# Altium schematic sheet Sheet1.SchDoc
size A3
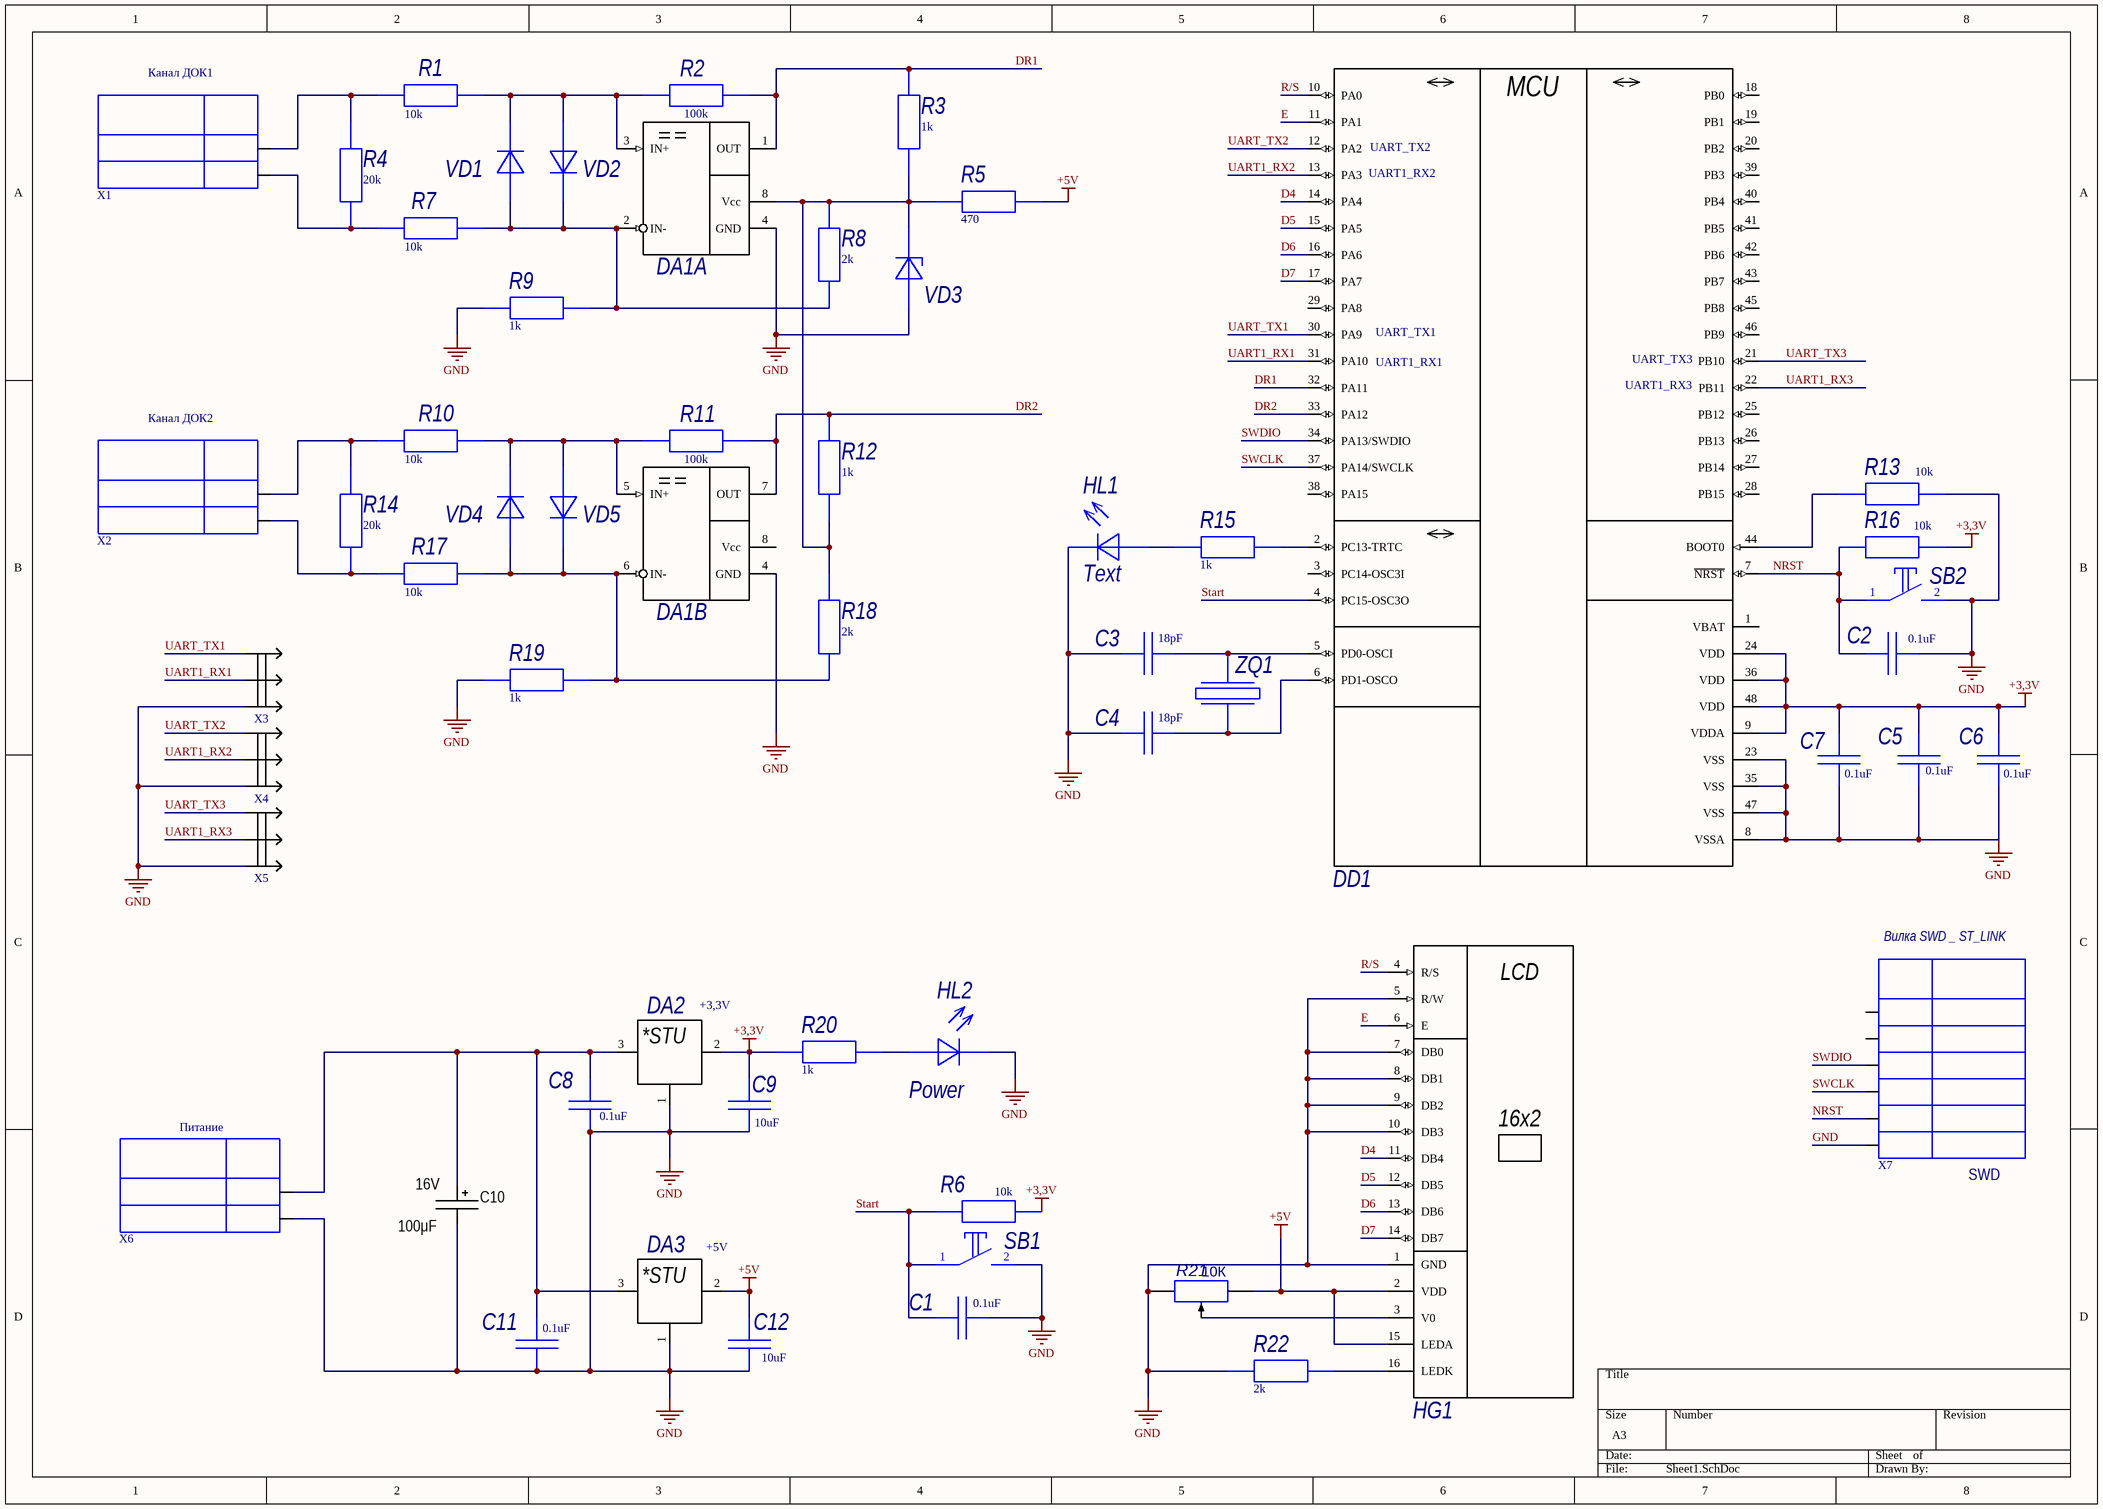
[diagram p0: Sheet1.SchDoc]

## Parts
C1  value 0.1uF  [C0805]  (hidden comment: Capacitor)
C2  value 0.1uF  [C0805]  (hidden comment: Capacitor)
C3  value 18pF  [C0603]  (hidden comment: Capacitor)
C4  value 18pF  [C0603]  (hidden comment: Capacitor)
C5  value 0.1uF  [C0805]  (hidden comment: Capacitor)
C6  value 0.1uF  [C0805]  (hidden comment: Capacitor)
C7  value 0.1uF  [C0805]  (hidden comment: Capacitor)
C8  value 0.1uF  [C0805]  (hidden comment: Capacitor)
C9  value 10uF  [C0805]  (hidden comment: Capacitor)
C10  value 100μF  Voltage: 16V  [CAP: D5C2H11]
C11  value 0.1uF  [C0805]  (hidden comment: Capacitor)
C12  value 10uF  [C0805]  (hidden comment: Capacitor)
DA1  COMP_2x_8p  [SOIC-8]  (value not drawn)  (parts A,B of 2)
DA2  Output Voltage: +3,3V  [SOT-223]  (hidden comment: LM1117-Series)
DA3  Output Voltage: +5V  [SOT-223]  (hidden comment: LM1117-Series)
DD1  STM32F103Cxxx-Series  [LQFP-48]  (value not drawn)
HG1  QC1602AV2_0  [QC1602AV2_0 _PLS]  (value not drawn)
HL1  Text  [LD-3mm-G]
HL2  Power  [LD-3mm-R]
R1  value 10k  [R0805]  (hidden comment: Resistor)
R2  value 100k  [R0805]  (hidden comment: Resistor)
R3  value 1k  [R0805]  (hidden comment: Resistor)
R4  value 20k  [R0603]  (hidden comment: Resistor)
R5  value 470  [R0805]  (hidden comment: Resistor)
R6  value 10k  [R0805]  (hidden comment: Resistor)
R7  value 10k  [R0805]  (hidden comment: Resistor)
R8  value 2k  [R0805]  (hidden comment: Resistor)
R9  value 1k  [R0805]  (hidden comment: Resistor)
R10  value 10k  [R0805]  (hidden comment: Resistor)
R11  value 100k  [R0805]  (hidden comment: Resistor)
R12  value 1k  [R0805]  (hidden comment: Resistor)
R13  value 10k  [R0805]  (hidden comment: Resistor)
R14  value 20k  [R0603]  (hidden comment: Resistor)
R15  value 1k  [R0805]  (hidden comment: Resistor)
R16  value 10k  [R0805]  (hidden comment: Resistor)
R17  value 10k  [R0805]  (hidden comment: Resistor)
R18  value 2k  [R0805]  (hidden comment: Resistor)
R19  value 1k  [R0805]  (hidden comment: Resistor)
R20  value 1k  [R0805]  (hidden comment: Resistor)
R21  value 10К  [CA9V]  (hidden comment: Potentiometer)
R22  value 2k  [R0805]  (hidden comment: Resistor)
SB1  Text  [TS-A3PS]  (value not drawn)
SB2  Text  [TS-A3PS]  (value not drawn)
VD1  Diode  [DO-214AC]  (value not drawn)
VD2  Diode  [DO-214AC]  (value not drawn)
VD3  Zener  [SOD-80]  (value not drawn)
VD4  Diode  [DO-214AC]  (value not drawn)
VD5  Diode  [DO-214AC]  (value not drawn)
X1  Канал ДОК1  [2EDGV-5.0-02P-14]
X2  Канал ДОК2  [2EDGV-5.0-02P-14]
X3  Разъем PLS-3  [HDR1X3]  (value not drawn)
X4  Разъем PLS-3  [HDR1X3]  (value not drawn)
X5  Разъем PLS-3  [HDR1X3]  (value not drawn)
X6  Питание  [2EDGV-5.0-02P-14]
X7  Вилка SWD _ ST_LINK  value SWD  [PLD6]
ZQ1  Crystal  [HC-49SM]  (value not drawn)

## Nets
+3,3V: C5.2 C6.2 C7.2 C9.2 DA2.2(Out) DD1.9(VDDA) DD1.24(VDD) DD1.36(VDD) DD1.48(VDD) R6.1 R16.1 R20.1
+5V: C12.2 DA3.2(Out) HG1.2(VDD) HG1.15(LEDA) R5.2 R21.1
GND: C1.1 C2.1 C3.1 C4.1 C5.1 C6.1 C7.1 C8.1 C9.1 C10.2 C11.1 C12.1 DA1.4(GND) DA2.1(Adj/GND) DA3.1(Adj/GND) DD1.8(VSSA) DD1.23(VSS) DD1.35(VSS) DD1.47(VSS) HG1.1(GND) HG1.5(R/W) HG1.7(DB0) HG1.8(DB1) HG1.9(DB2) HG1.10(DB3) HL1.2(К) HL2.2(К) R9.1 R13.1 R19.1 R21.2 R22.2 SB1.2 SB2.2 VD3.1(А) X3.1 X4.1 X5.1 X6.2(PIN1) X7.6
D4: DD1.14(PA4) HG1.11(DB4)
D5: DD1.15(PA5) HG1.12(DB5)
D6: DD1.16(PA6) HG1.13(DB6)
D7: DD1.17(PA7) HG1.14(DB7)
DR1: DA1.1(OUT) DD1.32(PA11) R2.2 R3.2
DR2: DA1.7(OUT) DD1.33(PA12) R11.2 R12.2
E: DD1.11(PA1) HG1.6(E)
NRST: C2.2 DD1.7(~{NRST}) R16.2 SB2.1 X7.5
R/S: DD1.10(PA0) HG1.4(R/S)
Start: C1.2 DD1.4(PC15-OSC3O) R6.2 SB1.1
SWCLK: DD1.37(PA14/SWCLK) X7.4
SWDIO: DD1.34(PA13/SWDIO) X7.3(GND)
UART1_RX1: DD1.31(PA10) X3.2
UART1_RX2: DD1.13(PA3) X4.2
UART1_RX3: DD1.22(PB11) X5.2
UART_TX1: DD1.30(PA9) X3.3
UART_TX2: DD1.12(PA2) X4.3
UART_TX3: DD1.21(PB10) X5.3
NetC3_2: C3.2 DD1.5(PD0-OSCI) ZQ1.3
NetC4_2: C4.2 DD1.6(PD1-OSCO) ZQ1.1
NetC8_2: C8.2 C10.1 C11.2 DA2.3(In) DA3.3(In) X6.1(PIN2)
NetDA1_2: DA1.2(IN-) R7.2 R8.1 R9.2 VD1.1(А) VD2.2(К)
NetDA1_3: DA1.3(IN+) R1.2 R2.1 VD1.2(К) VD2.1(А)
NetDA1_5: DA1.5(IN+) R10.2 R11.1 VD4.2(К) VD5.1(А)
NetDA1_6: DA1.6(IN-) R17.2 R18.1 R19.2 VD4.1(А) VD5.2(К)
NetDA1_8: DA1.8(Vcc) R3.1 R5.1 R8.2 R12.1 R18.2 VD3.2(К)
NetDD1_2: DD1.2(PC13-TRTC) R15.1
NetDD1_44: DD1.44(BOOT0) R13.2
NetHG1_3: HG1.3(V0) R21.3
NetHG1_16: HG1.16(LEDK) R22.1
NetHL1_1: HL1.1(А) R15.2
NetHL2_1: HL2.1(А) R20.2
NetR1_1: R1.1 R4.2 X1.1(PIN2)
NetR4_1: R4.1 R7.1 X1.2(PIN1)
NetR10_1: R10.1 R14.2 X2.1(PIN2)
NetR14_1: R14.1 R17.1 X2.2(PIN1)

Not connected (* = marked no-connect by the designer): DD1 1(VBAT) 3(PC14-OSC3I) 18(PB0) 19(PB1) 20(PB2) 25(PB12) 26(PB13) 27(PB14) 28(PB15) 29(PA8) 38(PA15) 39(PB3) 40(PB4) 41(PB5) 42(PB6) 43(PB7) 45(PB8) 46(PB9); X7 1(VCC) 2(TDO)

## Notes on the sheet
- (near DD1) UART1_RX2
- (near DD1) UART_TX2
- (near DD1) UART_TX1
- (near DD1) UART1_RX1
- (near DD1) UART_TX3
- (near DD1) UART1_RX3
- (in symbol LM1117MPX-3.3) *STU
- (in symbol QC1602AV2_0 _PLS) LCD; 16x2
- (in symbol STM32F103C8T6) MCU

## Library data of the parts
C1 C2 C5-C8 C11 = GRM21BR71H104KA01L: Manufacturer: Murata; Type: Конденсатор; ID: 138; Voltage: 50V; Tolerance: ±10%; Dielectric Type: X7R; Application Category: 1; Working Temperature Min: -55°С; Working Temperature Max: +125°С; Published: 18.05.2010; Publisher: Andrew Danich; Part Number: GRM21BR71H104KA01L; Footprint: 0805
C3 C4 = GRM188R71E223KA01D: Manufacturer: Murata; Type: Конденсатор; ID: 128; Voltage: 25V; Tolerance: ±10%; Dielectric Type: X7R; Application Category: 1; Working Temperature Min: -55°С; Working Temperature Max: +125°С; Published: 18.05.2010; Publisher: Andrew Danich; Part Number: GRM188R71E223KA01D; Footprint: 0603
C9 C12 = GRM21BR61E106KA73L: Manufacturer: Murata; Type: Конденсатор; ID: 53; Voltage: 25V; Tolerance: ±10%; Dielectric Type: X5R; Published: 18.05.2010; Publisher: Andrew Danich; Part Number: GRM21BR61E106KA73L; Footprint: 0805
C10 = Aluminium: Manufacturer: Wurth; PartNumber: 860080475013; ValueManufacturerPartNumber: Aluminium capacitor, 100μF, 16V, ±20%, 54mOhm, 14x10x5 mm, -55...+105°C; TypeCapacitor: Aluminium capacitor; Tolerance: ±20%; Impedance: 54mOhm; Package: 14x10x5 mm; HelpURL: https://www.digikey.com/product-detail/en/wurth-electronics-inc/860080475013/732-9029-1-ND/5728972; Temperature: -55...+105°C
DA1 = LM293AD: Manufacturer: Texas Instruments; ID: 3; Supply Operation: +2…36V; Supply Current: 1mA; Input Biasing Current: 100nA; Input Offset Voltage: ±2mV; Channels: 2; Response Time: 1.3uS; Output Saturation Voltage: 400mV; Application Category: 1; Working Temperature Min: -25°C; Working Temperature Max: +85°C; Functional Analog: LM2903MX, LM393MX; Type: Микросхема; Publisher: Viktor Klishin; Part Number: LM293AD; Value: LM293AD
DA2 DA3 = LM1117MPX-3.3: ID: 9; Input Voltage: +8.5…20V; Output Current: 800mA; Published: 13.08.2015; Publisher: Andrew Danich; Type: Микросхема; Part Number: LM1117MPX-3.3; Value: LM1117MPX-3.3
DD1 = STM32F103C8T6: Manufacturer: STMicroelectronics; ID: 20; Supply Operation: +2.0…3.6V; Flash: 64K; SRAM: 20K; Prog Interface: JTAG, SWD, UART; I/O Lines: 37; Operation Frequency: 72MHz; Application Category: 1; Working Temperature Min: -40°С; Working Temperature Max: +85°С; Published: 16.10.2015; Publisher: Andrew Danich; Type: Микросхема; Part Number: STM32F103C8T6; Value: STM32F103C8T6; EEPROM: -
HG1 = QC1602AV2_0 _PLS: ID: 1; Name: LCD16X2; Published: 28.08.2014; Publisher: Andrew Danich; Type: Индикатор графический; Part Number: QC1602AV2_0 _PLS; ComponentLink1URL: https://www.openhacks.com/uploadsproductos/eone-1602a1.pdf; ComponentLink1Description: Datashet; ChipdipURL: https://www.chipdip.ru/product/bcb1602-03; Value: QC1602AV2_0
HL1 = BL-L314UGC: Type: Индикатор единичный; ID: 1; Forward Voltage: 2.2V; Forward Current: 30mA; Power Dissipation: 75mW; Color: Ultra Green; Published: 03.12.2013; Publisher: Andrew Danich; Part Number: BL-L314UGC; Value: BL-L314UGC; Leds: 1; Footprint: 3mm; Application Category: 1
HL2 = BL-L314HD: Type: Индикатор единичный; ID: 2; Forward Voltage: 2.25V; Forward Current: 25mA; Power Dissipation: 60mW; Color: Red; Leds: 1; Published: 03.12.2013; Publisher: Andrew Danich; Part Number: BL-L314HD; Value: BL-L314HD; Footprint: 3mm; Application Category: 1
R1 R6 R7 R10 R13 R16 R17 = RC0805JR-0710KL: Manufacturer: Yageo; ID: 99; Limit Voltage: 150V; Tolerance: ±5%; Temperature Coefficient: 100ppm; Total Power Dissipation: 0.125W; Series Type: Thick-Film; Application Category: 1; Working Temperature Min: -55°С; Working Temperature Max: +155°С; Published: 24.03.2010; Publisher: Andrew Danich; Type: Резистор; Part Number: RC0805JR-0710KL; Footprint: 0805
R2 R11 = RC0805JR-0733KL: Manufacturer: Yageo; ID: 136; Limit Voltage: 150V; Tolerance: ±5%; Temperature Coefficient: 100ppm; Total Power Dissipation: 0.125W; Series Type: Thick-Film; Application Category: 1; Working Temperature Min: -55°С; Working Temperature Max: +155°С; Published: 24.03.2010; Publisher: Andrew Danich; Type: Резистор; Part Number: RC0805JR-0733KL; Footprint: 0805
R3 R9 R12 R15 R19 R20 = RC0805JR-071KL: Manufacturer: Yageo; ID: 112; Limit Voltage: 150V; Tolerance: ±5%; Temperature Coefficient: 100ppm; Total Power Dissipation: 0.125W; Series Type: Thick-Film; Application Category: 1; Working Temperature Min: -55°С; Working Temperature Max: +155°С; Published: 24.03.2010; Publisher: Andrew Danich; Type: Резистор; Part Number: RC0805JR-071KL; Footprint: 0805
R4 R14 = RC0603FR-0720KL: Manufacturer: Yageo; ID: 259; Limit Voltage: 50V; Tolerance: ±1%; Temperature Coefficient: 100ppm; Total Power Dissipation: 0.1W; Series Type: Thick-Film; Application Category: 1; Working Temperature Min: -55°С; Working Temperature Max: +155°С; Published: 24.03.2010; Publisher: Andrew Danich; Type: Резистор; Part Number: RC0603FR-0720KL; Footprint: 0603
R5 = RC0805JR-07470RL: Manufacturer: Yageo; ID: 144; Limit Voltage: 150V; Tolerance: ±5%; Temperature Coefficient: 100ppm; Total Power Dissipation: 0.125W; Series Type: Thick-Film; Application Category: 1; Working Temperature Min: -55°С; Working Temperature Max: +155°С; Published: 24.03.2010; Publisher: Andrew Danich; Type: Резистор; Part Number: RC0805JR-07470RL; Footprint: 0805
R8 R18 R22 = RC0805JR-072KL: Manufacturer: Yageo; ID: 129; Limit Voltage: 150V; Tolerance: ±5%; Temperature Coefficient: 100ppm; Total Power Dissipation: 0.125W; Series Type: Thick-Film; Application Category: 1; Working Temperature Min: -55°С; Working Temperature Max: +155°С; Published: 24.03.2010; Publisher: Andrew Danich; Type: Резистор; Part Number: RC0805JR-072KL; Footprint: 0805
R21 = CA9PV10-10KA2020: ID: 6; Name: Resistor; Nominal value: 10; Units: К; SortUnit: 2; Type: Резистор; Part Number: CA9PV10-10KA2020; ComponentLink1URL: https://static.chipdip.ru/lib/250/DOC000250611.pdf; ComponentLink1Description: Datashet; ChipdipURL: https://www.chipdip.ru/product0/9000079478
SB1 SB2 = TS-A3PS-130: ID: 24; Limit Voltage: 250V; Limit Current: 50mA; Resistance: 0.1ohm; Isolator Resistance: 100meg; Backlight: NO; Number of Contacts: 4; Application Category: 1; Published: 17.04.2014; Publisher: Andrew Danich; Type: Переключатель; Part Number: TS-A3PS-130; Value: TS-A3PS-130; Height: 7mm
VD1 VD2 VD4 VD5 = ES1G: Part Number: ES1G; Type: Диод; ID: 3; Value: ES1F; Reverse Voltage: 400V; Reverse Current: 5uA; Forward Voltage: 1.3V; Forward Current: 1A; Total Power Dissipation: 1.47W; Capacitance: 10pF; Recovery Time: 35nS; Published: 18.05.2010; Publisher: Andrew Danich
VD3 = BZV55-C5V1: Type: Стабилитрон; ID: 1; Working Voltage: 5.1V; Reverse Current: 2uA; Forward Voltage: 0.9V; Forward Current: 250mA; Total Power Dissipation: 0.5W; Capacitance: 300pF; Differential resistance: 60ohm; Published: 20.05.2013; Publisher: Andrew Danich; Part Number: BZV55-C5V1; Value: BZV55-C5V1
X1 X2 X6 = Вилка 2EDGV-5.08-02P
X3-X5 = Вилка 3pin: Вилка штыревая 2.54мм 1x3 прямая в отверстия
X7 = Вилка SWD _ ST_LINK: Вилка 2x3 pin 2.54 mm в отверстия
ZQ1 = HC49SM-8.000MHz-20pF: ID: 17; Value: HC49S-8.000MHZ-20pF; Output Frequency: 8MHz; Load Capacitance: 20pF; Temperature Coefficient: ±50ppm; Application Category: 1; Published: 08.03.2013; Publisher: Andrew Danich; Type: Резонатор; Part Number: HC49SM-8.000MHz-20pF